# EAGLE design KickerBoard5 (EAGLE 6.5.0)
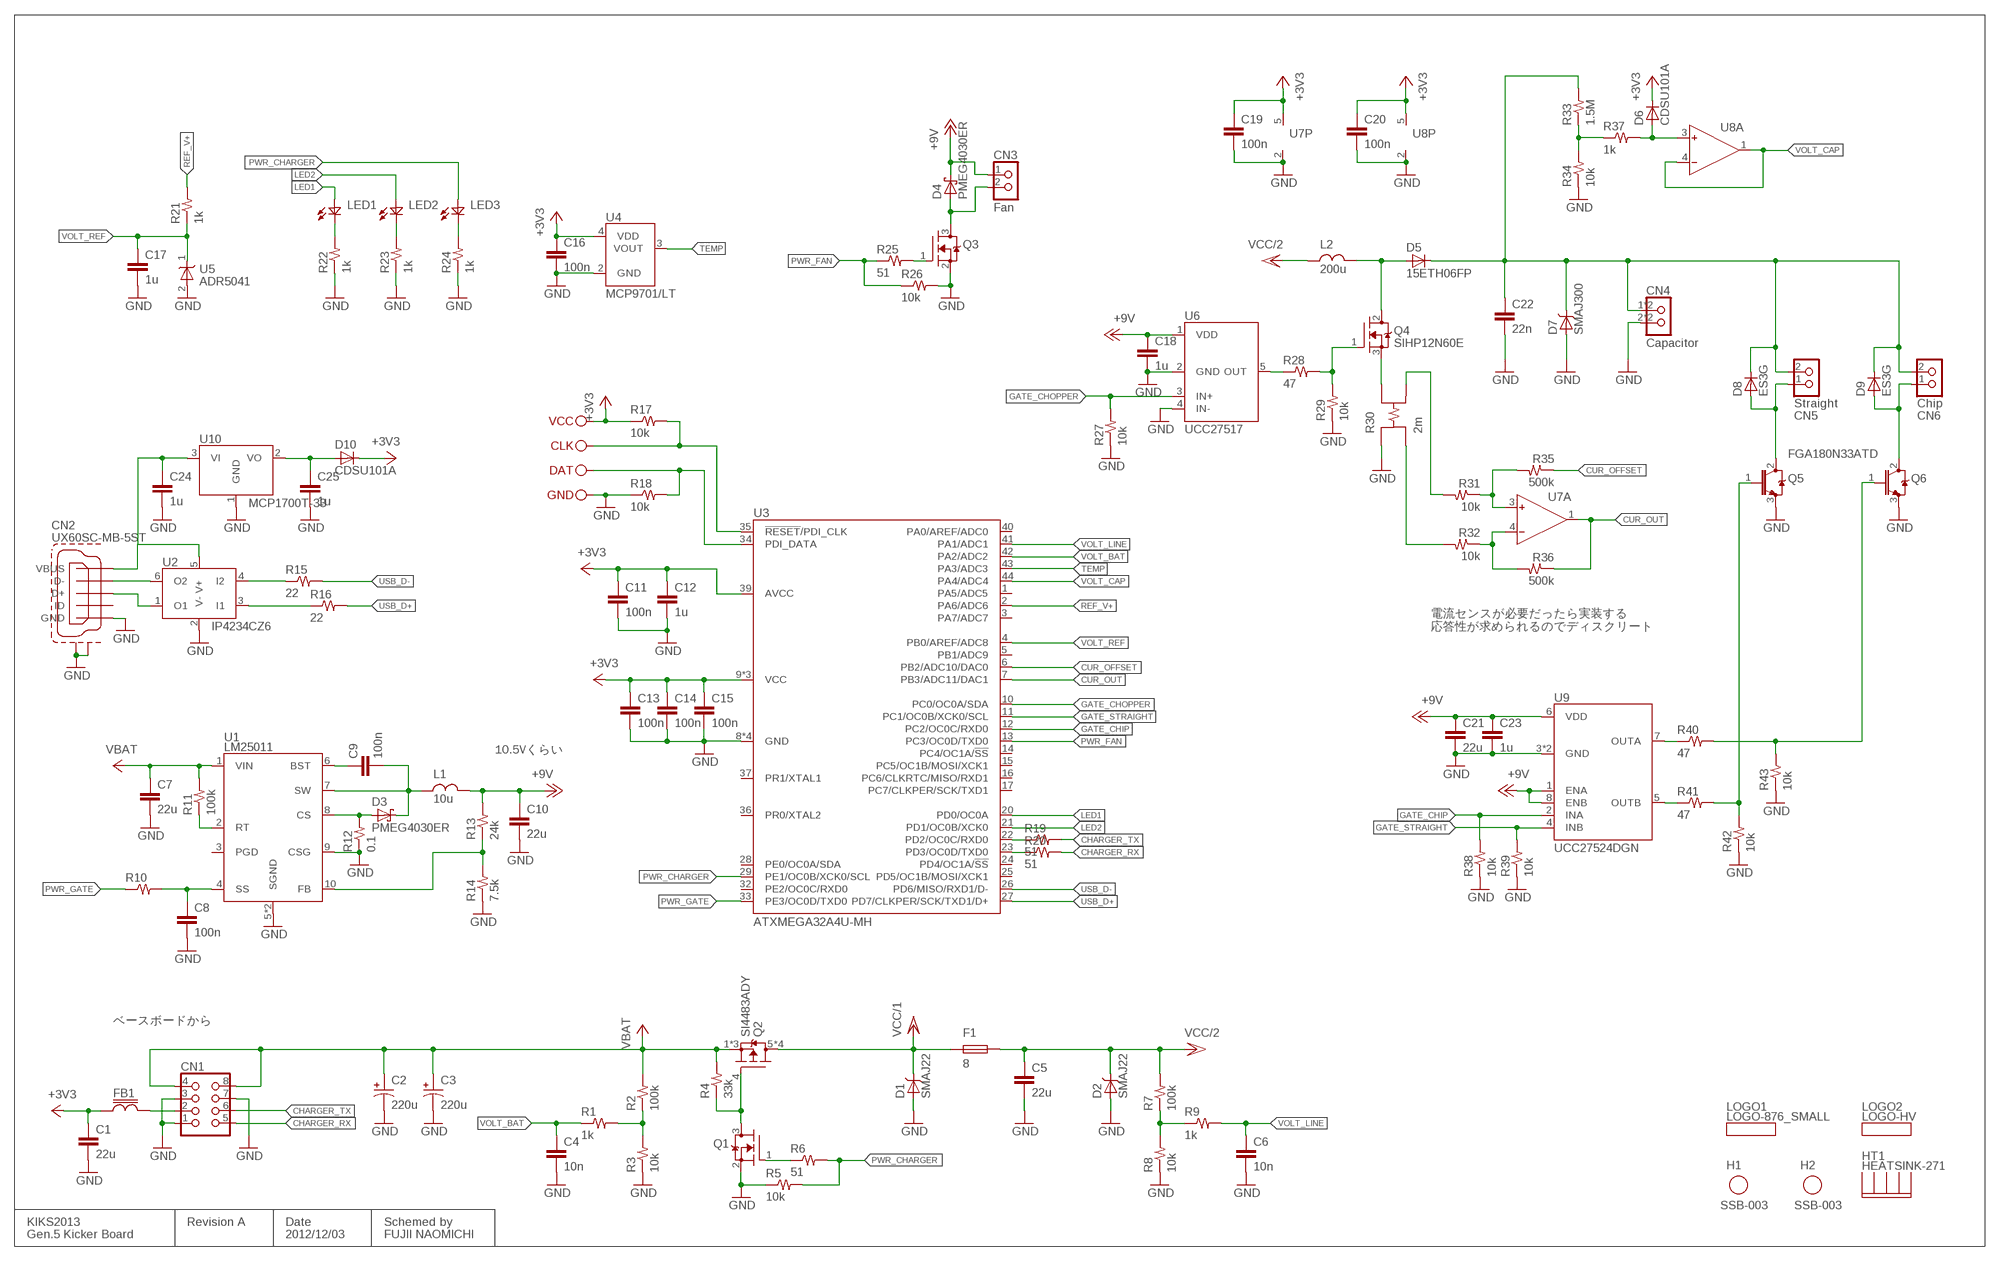
[diagram p0: schematic, sheet 1]

## Parts
C1  22u  C2012  [2012]
C2  220u  CPOL3.5-8  [E3.5-8]
C3  220u  CPOL3.5-8  [E3.5-8]
C4  10n  C1005  [1005]
C5  22u  C3225  [3225]
C6  10n  C1005  [1005]
C7  22u  C3216  [3216]
C8  100n  C1005  [1005]
C9  100n  C1608  [1608]
C10  22u  C3216  [3216]
C11  100n  C1005  [1005]
C12  1u  C1608  [1608]
C13  100n  C1005  [1005]
C14  100n  C1005  [1005]
C15  100n  C1005  [1005]
C16  100n  C1005  [1005]
C17  1u  C1005  [1005]
C18  1u  C1608  [1608]
C19  100n  C1005  [1005]
C20  100n  C1005  [1005]
C21  22u  C3216  [3216]
C22  22n  C3216  [3216]
C23  1u  C1608  [1608]
C24  1u  C1005  [1005]
C25  1u  C1005  [1005]
CN1  43045-0800  [43045-0800]
CN2  UX60SC-MB-5ST  [UX60SC-MB-5ST]
CN3  Fan  PIN1X2  [PIN1X2]
CN4  Capacitor  TERMINAL2P-V-SL  [TERMINAL2P-V-SCLEWLESS]
CN5  Straight  5569-02A2  [5569-02A2]
CN6  Chip  5569-02A2  [5569-02A2]
D1  SMAJ22  ZENER-DO-214AC  [DO-214AC]
D2  SMAJ22  ZENER-DO-214AC  [DO-214AC]
D3  PMEG4030ER  SBD-SDO123W  [SOD123W]
D4  PMEG4030ER  SBD-SDO123W  [SOD123W]
D5  15ETH06FP  DIODE-TO-220F  [TO-220F-2]
D6  CDSU101A  DIODE-1608  [1608]
D7  SMAJ300  ZENER-DO-214AC  [DO-214AC]
D8  ES3G  DIODE-DO-214AB  [DO-214AB]
D9  ES3G  DIODE-DO-214AB  [DO-214AB]
D10  CDSU101A  DIODE-1608  [1608]
F1  8  F3216  [3216]
FB1  FB1608  [1608]
H1  SSB-003  [SBB-003]
H2  SSB-003  [SBB-003]
HT1  HEATSINK-271  [271-AB]
L1  10u  L40  [L4040]
L2  200u  COIL-V  [COIL-V]
LED1  LED1608  [1608]
LED2  LED1608  [1608]
LED3  LED1608  [1608]
LOGO1  LOGO-876_SMALL  [LOGO-876_SMALL]
LOGO2  LOGO-HV  [LOGO-HIGHVOLTAGE]
P1  VCC  PAD  [PAD]
P2  CLK  PAD  [PAD]
P3  DAT  PAD  [PAD]
P4  GND  PAD  [PAD]
Q1  MOS-N-SOT23  [SOT23-3]
Q2  SI4483ADY  MOS-P-SOP8  [SOP8]
Q3  MOS-N-SOT23  [SOT23-3]
Q4  SIHP12N60E  MOS-N-TO-220F  [TO-220F]
Q5  FGA180N33ATD  IGBT-NTO-3P  [TO-3P]
Q6  FGA180N33ATD  IGBT-NTO-3P  [TO-3P]
R1  1k  R1005  [1005]
R2  100k  R1608  [1608]
R3  10k  R1608  [1608]
R4  33k  R1005  [1005]
R5  10k  R1005  [1005]
R6  51  R1005  [1005]
R7  100k  R1608  [1608]
R8  10k  R1608  [1608]
R9  1k  R1005  [1005]
R10  R1005  [1005]
R11  100k  R1005  [1005]
R12  0.1  R2012  [2012]
R13  24k  R1608  [1608]
R14  7.5k  R1608  [1608]
R15  22  R1005  [1005]
R16  22  R1005  [1005]
R17  10k  R1005  [1005]
R18  10k  R1005  [1005]
R19  51  R1005  [1005]
R20  51  R1005  [1005]
R21  1k  R1005  [1005]
R22  1k  R1005  [1005]
R23  1k  R1005  [1005]
R24  1k  R1005  [1005]
R25  51  R1005  [1005]
R26  10k  R1005  [1005]
R27  10k  R1005  [1005]
R28  47  R3216  [3216]
R29  10k  R1005  [1005]
R30  2m  FC4L  [FC4L]
R31  10k  R1608  [1608]
R32  10k  R1608  [1608]
R33  1.5M  R1608  [1608]
R34  10k  R1608  [1608]
R35  500k  R1608  [1608]
R36  500k  R1608  [1608]
R37  1k  R1005  [1005]
R38  10k  R1005  [1005]
R39  10k  R1005  [1005]
R40  47  R3216  [3216]
R41  47  R3216  [3216]
R42  10k  R1005  [1005]
R43  10k  R1005  [1005]
U1  LM25011  [MSOP10-PAD]
U2  IP4234CZ6  TPD2S017  [SOT23-6]
U3  ATXMEGA32A4U-MH  [QFN44-0.5]
U4  MCP9701/LT  [SC70-6]
U5  ADR5041  [SC70-3]
U6  UCC27517  [SOT23-5]
U7  SINGLE-OPAMP-ISO-SOT23  [SOT23-5]
U8  SINGLE-OPAMP-ISO-SOT23  [SOT23-5]
U9  UCC27524DGN  [MSOP8-PAD]
U10  MCP1700T-33  [SOT23-3]

## Nets
+3V3: C1.1 C11.1 C12.1 C13.1 C14.1 C15.1 C16.1 C19.1 C20.1 D6.K D10.K FB1.1 P1.1 R17.1 U3.9(VCC) U3.19(VCC) U3.31(VCC) U3.39(AVCC) U4.4(VDD) U7.5(P:V+) U8.5(P:V+)
+9V: C10.1 C18.1 C21.1 C23.1 CN3.1 D4.K L1.2 R13.2 U6.1(VDD) U9.1(ENA) U9.6(VDD) U9.8(ENB)
CHARGER_RX: CN1.5 R20.2
CHARGER_TX: CN1.6 R19.2
CUR_OFFSET: R35.1 U3.6(PB2/ADC10/DAC0)
CUR_OUT: R36.1 U3.7(PB3/ADC11/DAC1) U7.1(A:OUT)
GATE_CHIP: R38.2 U3.12(PC2/OC0C/RXD0) U9.2(INA)
GATE_CHOPPER: R27.2 U3.10(PC0/OC0A/SDA) U6.3(IN+)
GATE_STRAIGHT: R39.2 U3.11(PC1/OC0B/XCK0/SCL) U9.4(INB)
GND: C1.2 C2.N C3.N C4.2 C5.2 C6.2 C7.2 C8.2 C10.2 C11.2 C12.2 C13.2 C14.2 C15.2 C16.2 C17.2 C18.2 C19.2 C20.2 C21.2 C22.2 C23.2 C24.2 C25.2 CN1.1 CN1.3 CN1.7 CN2.5(GND) CN2.S1 CN2.S2 CN4.2 CN4.2B D1.A D2.A D7.A P4.1 Q1.2(S) Q3.2(S) Q5.3(E) Q6.3(E) R3.1 R5.1 R8.1 R12.1 R14.1 R18.1 R22.1 R23.1 R24.1 R26.2 R27.1 R29.1 R30.V1 R34.1 R38.1 R39.1 R42.1 R43.1 U1.5(SGND) U1.9(CSG) U1.PAD(SGND) U2.2(V-) U3.8(GND) U3.18(GND) U3.30(GND) U3.38(GND) U4.2(GND) U5.2(A) U6.2(GND) U6.4(IN-) U7.2(P:V-) U8.2(P:V-) U9.3(GND) U9.PAD(GND) U10.1(GND)
LED1: LED1.A U3.20(PD0/OC0A)
LED2: LED2.A U3.21(PD1/OC0B/XCK0)
N$1: R11.1 U1.2(RT)
N$2: R1.2 R2.1 R3.2
N$3: R7.1 R8.2 R9.1
N$4: R40.1 U9.7(OUTA)
N$5: P2.1 R17.2 U3.35(!RESET!/PDI_CLK)
N$6: Q4.3(S) R30.V2
N$7: C24.1 CN2.1(VBUS) U2.5(V+) U10.3(VI)
N$8: P3.1 R18.2 U3.34(PDI_DATA)
N$9: D5.3(A) L2.2 Q4.2(D)
N$10: D6.A R37.2 U8.3(A:IN+)
N$11: CN2.2(D-) U2.6(O2)
N$12: C8.1 R10.2 U1.4(SS)
N$13: C9.1 U1.6(BST)
N$14: R30.I2 R31.2
N$15: R31.1 R35.2 U7.3(A:IN+)
N$16: R32.1 R36.2 U7.4(A:IN-)
N$17: R13.1 R14.2 U1.10(FB)
N$18: Q6.1(G) R40.2 R43.2
N$19: C9.2 D3.K L1.1 U1.7(SW)
N$20: CN2.3(D+) U2.1(O1)
N$21: CN5.1 D8.A Q5.2(C)
N$22: Q1.3(D) Q2.4(G) R4.1
N$23: R28.1 U6.5(OUT)
N$24: CN6.1 D9.A Q6.2(C)
N$25: Q4.1(G) R28.2 R29.2
N$26: LED2.K R23.2
N$27: R41.1 U9.5(OUTB)
N$28: Q5.1(G) R41.2 R42.2
N$29: R30.I1 R32.2
N$30: R19.1 U3.22(PD2/OC0C/RXD0)
N$31: D3.A R12.2 U1.8(CS)
N$32: R20.1 U3.23(PD3/OC0D/TXD0)
N$33: CN1.2 FB1.2
N$34: LED1.K R22.2
N$35: LED3.K R24.2
N$36: C25.1 D10.A U10.2(VO)
N$37: CN3.2 D4.A Q3.3(D)
N$38: R16.1 U2.3(I1)
N$39: Q3.1(G) R25.2
N$40: R15.1 U2.4(I2)
N$43: Q1.1(G) R6.1
PWR_CHARGER: LED3.A R5.2 R6.2 U3.29(PE1/OC0B/XCK0/SCL)
PWR_FAN: R25.1 R26.1 U3.13(PC3/OC0D/TXD0)
PWR_GATE: R10.1 U3.33(PE3/OC0D/TXD0)
REF_V+: R21.2 U3.2(PA6/ADC6)
TEMP: U3.43(PA3/ADC3) U4.3(VOUT)
USB_D+: R16.2 U3.27(PD7/CLKPER/SCK/TXD1/D+)
USB_D-: R15.2 U3.26(PD6/MISO/RXD1/D-)
VBAT: C2.P C3.P C7.1 CN1.4 CN1.8 Q2.1(S) Q2.2(S) Q2.3(S) R2.2 R4.2 R11.2 U1.1(VIN)
VCAP: C22.1 CN4.1 CN4.1B CN5.2 CN6.2 D5.1(K) D7.K D8.K D9.K R33.2
VCC/1: D1.K F1.1 Q2.5(D) Q2.6(D) Q2.7(D) Q2.8(D)
VCC/2: C5.1 D2.K F1.2 L2.1 R7.2
VOLT_BAT: C4.1 R1.1 U3.42(PA2/ADC2)
VOLT_CAP: U3.44(PA4/ADC4) U8.1(A:OUT) U8.4(A:IN-)
VOLT_LINE: C6.1 R9.2 U3.41(PA1/ADC1)
VOLT_LINE1: R33.1 R34.2 R37.1
VOLT_REF: C17.1 R21.1 U3.4(PB0/AREF/ADC8) U5.1(K)
Unconnected: CN2.4(ID) U1.3(PGD) U3.1(PA5/ADC5) U3.3(PA7/ADC7) U3.5(PB1/ADC9) U3.14(PC4/OC1A/!SS) U3.15(PC5/OC1B/MOSI/XCK1) U3.16(PC6/CLKRTC/MISO/RXD1) U3.17(PC7/CLKPER/SCK/TXD1) U3.24(PD4/OC1A/!SS) U3.25(PD5/OC1B/MOSI/XCK1) U3.28(PE0/OC0A/SDA) U3.32(PE2/OC0C/RXD0) U3.36(PR0/XTAL2) U3.37(PR1/XTAL1) U3.40(PA0/AREF/ADC0)

## Notes on the sheet
- 電流センスが必要だったら実装する
  応答性が求められるのでディスクリート
- 10.5Vくらい
- ベースボードから
- KIKS2013 | Revision A | Date | Schemed by
- Gen.5 Kicker Board | 2012/12/03 | FUJII NAOMICHI

## Library data of the parts
C1 C4-C25 = Passive:C
C2 C3 = Passive:CPOL
CN1 = con-Molex:43045-0800
CN2 = con-Hirose:UX60S
CN3 = Connector:PIN1X2
CN4 = ProjectOnly:TERMINAL2P
CN5 CN6 = con-Molex:5569-02A2
D1 D2 D7 = Diode:ZENER-*
D3 D4 = Diode:SBD-*
D5 D6 D8-D10 = Diode:DIODE-*
F1 = Passive:F
FB1 = Passive:FB
H1 H2 = ProjectOnly:SSB-00*
HT1 = ProjectOnly:HEATSINK
L1 = Passive:L
L2 = ProjectOnly:COIL
LED1-LED3 = Opto:LED
LOGO1 = ProjectOnly:LOGO-876_SMALL
LOGO2 = ProjectOnly:LOGO-HV
P1-P4 = ic-package:PAD
Q1 Q3 Q4 = Transistor:MOS-N-*
Q2 = Transistor:MOS-P-*
Q5 Q6 = Transistor:IGBT-N
R1-R29 R31-R43 = Passive:R
R30 = ProjectOnly:FC4L
U1 = ic-National:LM25011
U2 = ic-TI:TPD2S017
U3 = ic-ATMEL:ATXMEGA*A4U
U4 = ic-Microchip:MCP970*
U5 = ic-AD:ADR504*
U6 = ic-TI:UCC27517
U7 U8 = Opamp:SINGLE-OPAMP-ISO
U9 = ic-TI:UCC27524
U10 = ic-Microchip:MCP1700T-*

## Board
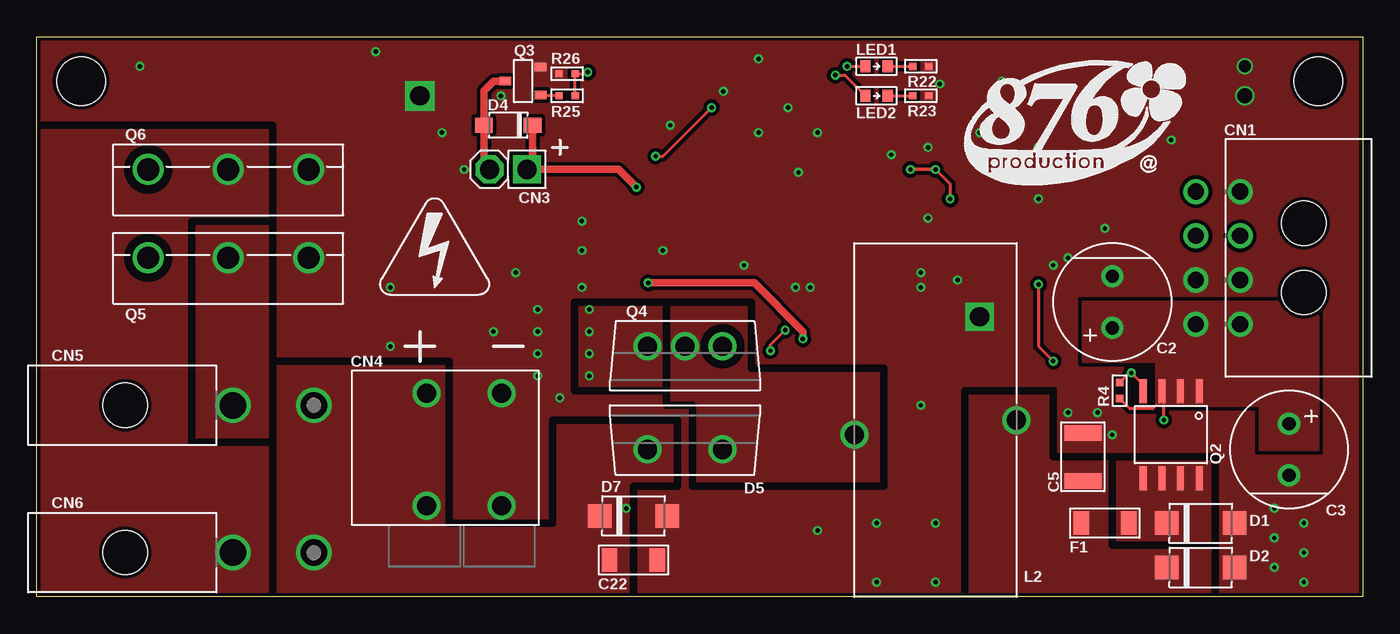
[diagram p1: board, top side]
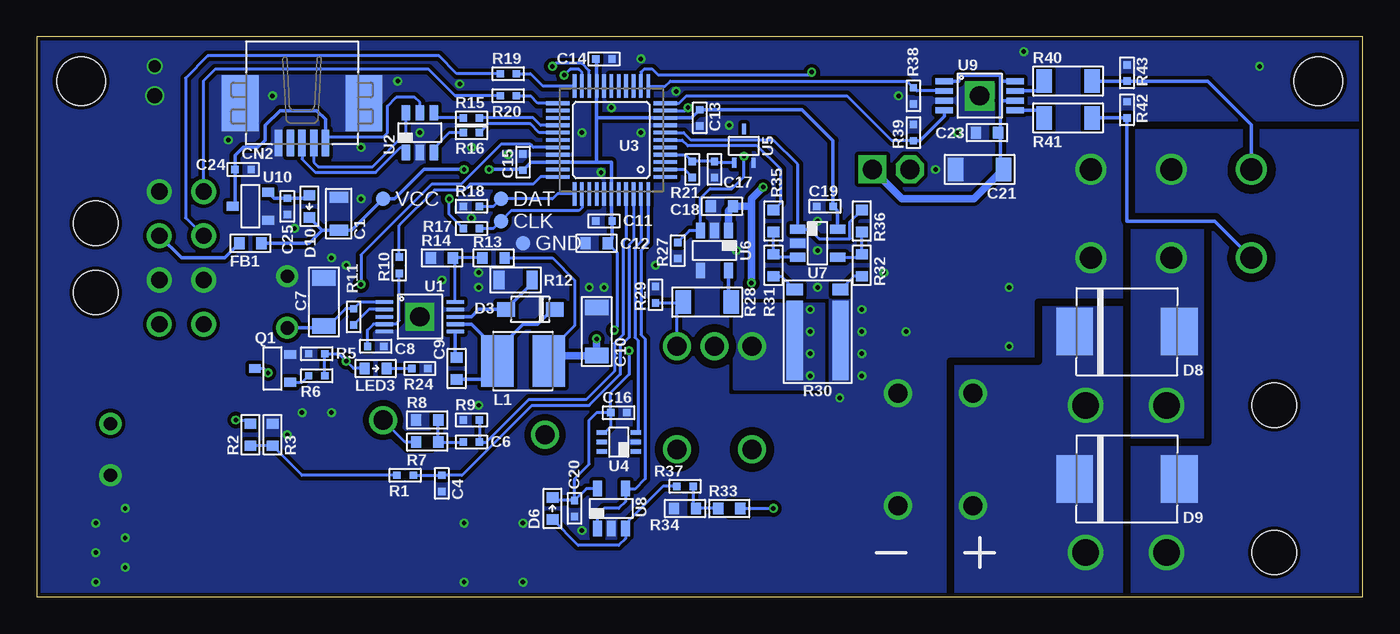
[diagram p2: board, bottom side, seen from below]

Size 90 x 38 mm. Coordinates in mm from the lower left corner, seen from the top.
Outline: 90,0 0,0 0,38 90,38 90,0
Copper layers (1*16): Top 0.035mm / dielectric 1.6mm / Bottom 0.035mm
Design rules "seeedstudio": minimum track width 6mil, minimum drill 0.3mm, track to track 6mil, track to pad 6mil, pad to pad 6mil, via to via 6mil, smd to smd 6mil, copper to edge 10mil, drill to drill 10mil, minimum pad ring 0.2mm, minimum via ring 6mil, stop-mask expansion 4mil, vias tented up to drill 3mm, thermal gap 10mil
tRestrict: area 6.2,21.7 to 8.9,24.3; area 6.2,27.7 to 8.9,30.3; area 45.3,15.8 to 47.8,18.2; 37 lines
bRestrict: area 40.2,8.8 to 42.7,11.2; area 45.3,8.8 to 47.8,11.2; area 54.4,9.9 to 56.6,12.1; area 42.8,15.8 to 45.2,18.2; 37 lines

### Footprints (pad centres in the part's own frame; a part is rotated, then mirrored left to right if it is on the bottom)
2012 = smd 0.75 x 1.25: 1 -1.125,0; 2 1.125,0
E3.5-8 = drill 0.9 pad 1.5: N 1.75,0; P -1.75,0
1005 = smd 0.5 x 0.5: 1 -0.55,0; 2 0.55,0
3225 = smd 1.05 x 2.5: 1 -1.625,0; 2 1.625,0
3216 = smd 1.05 x 1.6: 1 -1.625,0; 2 1.625,0
1608 = smd 0.7 x 0.8: 1 -0.75,0; 2 0.75,0
43045-0800 = drill 1.1 pad 1.7: 1 -4.5,-4.32; 2 -1.5,-4.32; 3 1.5,-4.32; 4 4.5,-4.32; 5 -4.5,-7.32; 6 -1.5,-7.32; 7 1.5,-7.32; 8 4.5,-7.32 | hole 3: 2.35,0; -2.35,0
UX60SC-MB-5ST = smd 1.8 x 0.5: 1 2.7,1.6; 2 2.7,0.8; 3 2.7,0; 4 2.7,-0.8; 5 2.7,-1.6 | smd 3.8 x 2.5: S1 0,-4.2; S2 0,4.2
PIN1X2 = drill 1.3 square: 1 -1.27,0 | drill 1.3 octagon: 2 1.27,0
TERMINAL2P-V-SCLEWLESS = drill 1.3 pad 1.9: 1 -2.54,-3.81; 1B -2.54,3.81; 2 2.54,-3.81; 2B 2.54,3.81
5569-02A2 = drill 1.8 pad 2.4: 1 0,-7.3; 2 0,-12.8 | hole 3: 0,0
DO-214AC = smd 1.6 x 1.6: A 2.3,0; K -2.3,0
SOD123W = smd 1.2 x 1: A 1.65,0; K -1.65,0
TO-220F-2 = drill 1.3 pad 1.9: 1 -2.54,0; 3 2.54,0
1608' = smd 0.7 x 0.8: A 0.75,0; K -0.75,0
DO-214AB = smd 2.5 x 3.2: A 3.55,0; K -3.55,0
SBB-003 = hole 3.3: 0,0
L4040 = smd 2.2 x 3.5: 1 -1.75,0; 2 1.75,0
COIL-V = drill 1.3 pad 1.9: 1 -5.5,0; 2 5.5,1
PAD = smd 1 x 1: 1 0,0
SOT23-3 = smd 0.6 x 0.8: 1 -0.95,-1.2; 2 0.95,-1.2; 3 0,1.2
SOP8 = smd 0.48 x 1.6: 1 -1.905,-2.95; 2 -0.635,-2.95; 3 0.635,-2.95; 4 1.905,-2.95; 5 1.905,2.95; 6 0.635,2.95; 7 -0.635,2.95; 8 -1.905,2.95
TO-220F = drill 1.3 pad 1.9: 1 -2.54,0; 2 0,0; 3 2.54,0
TO-3P = drill 1.5 pad 2.1: 1 -5.45,0; 2 0,0; 3 5.45,0
FC4L = smd 1.1 x 0.8: I1 -1.55,-2.85; I2 1.55,-2.85 | smd 1.1 x 5.4: V1 -1.55,0.6; V2 1.55,0.6
MSOP10-PAD = smd 0.25 x 1.2: 1 -1,-2.4; 2 -0.5,-2.4; 3 0,-2.4; 4 0.5,-2.4; 5 1,-2.4; 6 1,2.4; 7 0.5,2.4; 8 0,2.4; 9 -0.5,2.4; 10 -1,2.4 | drill 1.3 pad 1.9 square: PAD 0,0
SOT23-6 = smd 0.6 x 1.05: 1 -0.95,-1.35; 2 0,-1.35; 3 0.95,-1.35; 4 0.95,1.35; 5 0,1.35; 6 -0.95,1.35
QFN44-0.5 = smd 1.6 x 0.25: 1 -3.65,2.5; 2 -3.65,2; 3 -3.65,1.5; 4 -3.65,1; 5 -3.65,0.5; 6 -3.65,0; 7 -3.65,-0.5; 8 -3.65,-1; 9 -3.65,-1.5; 10 -3.65,-2; 11 -3.65,-2.5; 23 3.65,-2.5; 24 3.65,-2; 25 3.65,-1.5; 26 3.65,-1; 27 3.65,-0.5; 28 3.65,0; 29 3.65,0.5; 30 3.65,1; 31 3.65,1.5; 32 3.65,2; 33 3.65,2.5 | smd 0.25 x 1.6: 12 -2.5,-3.65; 13 -2,-3.65; 14 -1.5,-3.65; 15 -1,-3.65; 16 -0.5,-3.65; 17 0,-3.65; 18 0.5,-3.65; 19 1,-3.65; 20 1.5,-3.65; 21 2,-3.65; 22 2.5,-3.65; 34 2.5,3.65; 35 2,3.65; 36 1.5,3.65; 37 1,3.65; 38 0.5,3.65; 39 0,3.65; 40 -0.5,3.65; 41 -1,3.65; 42 -1.5,3.65; 43 -2,3.65; 44 -2.5,3.65
SC70-6 = smd 0.3 x 0.7: 1 -0.65,-1.15; 2 0,-1.15; 3 0.65,-1.15; 4 0.65,1.15; 5 0,1.15; 6 -0.65,1.15
SC70-3 = smd 0.3 x 0.7: 1 -0.65,-1.15; 2 0.65,-1.15; 3 0,1.15
SOT23-5 = smd 0.6 x 1.05: 1 -0.95,-1.35; 2 0,-1.35; 3 0.95,-1.35; 4 0.95,1.35; 5 -0.95,1.35
MSOP8-PAD = smd 0.4 x 1.2: 1 -0.975,-2.4; 2 -0.325,-2.4; 3 0.325,-2.4; 4 0.975,-2.4; 5 0.975,2.4; 6 0.325,2.4; 7 -0.325,2.4; 8 -0.975,2.4 | drill 1.3 pad 2 square: PAD 0,0

### Placement (x,y rotation side)
C1  69.5,26 90 bottom
C2  73,20 90 top
C3  85,10 270 top
C4  62.5,7.7 270 bottom
C5  71,9.5 90 top
C6  60.5,12 180 bottom
C7  70.5,20 90 bottom
C8  67,17 0 bottom
C9  61.5,15.5 270 bottom
C10  52,18 90 bottom
C11  51.5,25.5 180 bottom
C12  52,24 180 bottom
C13  45,32.5 270 bottom
C14  51.5,36.5 0 bottom
C15  57,29.5 90 bottom
C16  50.5,12.5 0 bottom
C17  44,29 270 bottom
C18  43.5,26.5 180 bottom
C19  36.5,26.5 180 bottom
C20  53.5,6 270 bottom
C21  26,29 180 bottom
C22  40.5,2.5 0 top
C23  25.5,31.5 180 bottom
C24  76,29 0 bottom
C25  73,26.5 270 bottom
CN1  86,23 270 top
CN2  72,33.5 270 bottom
CN3  32,29 180 top
CN4  29,10 0 top
CN5  6,13 90 top
CN6  6,3 90 top
D1  79,5 0 top
D2  79,2 0 top
D3  56.5,19.5 180 bottom
D4  32,32 180 top
D5  44,10 0 top
D6  CDSU101A  [1608']  55,6 270 bottom
D7  40.5,5.5 0 top
D8  16,18 0 bottom
D9  16,8 0 bottom
D10  CDSU101A  [1608']  71.5,26.5 90 bottom
F1  72.5,5 180 top
FB1  75.5,24 180 bottom
H1  3,35 0 top
H2  87,35 0 top
HT1  44,13 0 top
L1  57,16 0 bottom
L2  61,12 180 top
LED1  [1608']  57,36 180 top
LED2  [1608']  57,34 180 top
LED3  [1608']  67,15.5 180 bottom
LOGO1  63,28 0 top
LOGO2  27,23.5 0 top
P1  66.5,27 0 bottom
P2  58.5,25.5 0 bottom
P3  58.5,27 0 bottom
P4  57,24 0 bottom
Q1  74,15.5 90 bottom
Q2  77,11 180 top
Q3  33,35 90 top
Q4  44,17 180 top
Q5  13,23 0 top
Q6  13,29 0 top
R1  65,8.25 180 bottom
R2  75.5,11 90 bottom
R3  74,11 270 bottom
R4  73.5,14 270 top
R5  71,16.5 0 bottom
R6  71,15 0 bottom
R7  63.5,10.5 180 bottom
R8  63.5,12 0 bottom
R9  60.5,10.5 0 bottom
R10  65.4,22.5 270 bottom
R11  68.5,19 90 bottom
R12  57.5,21.5 0 bottom
R13  59,23 0 bottom
R14  62.5,23 0 bottom
R15  60.5,32.5 0 bottom
R16  60.5,31.5 0 bottom
R17  60.5,25 0 bottom
R18  60.5,26.5 0 bottom
R19  58,35.5 180 bottom
R20  58,34 180 bottom
R21  45.5,29 270 bottom
R22  60,36 180 top
R23  60,34 180 top
R24  64,15.5 180 bottom
R25  36,34 180 top
R26  36,35.5 180 top
R27  46.5,23.5 90 bottom
R28  44.5,20 180 bottom
R29  48,20.5 270 bottom
R30  37,18 180 bottom
R31  40,22.5 270 bottom
R32  34,22.5 270 bottom
R33  43,6 0 bottom
R34  46,6 0 bottom
R35  40,25.5 270 bottom
R36  34,25.5 270 bottom
R37  46,7.5 180 bottom
R38  30.5,34 90 bottom
R39  30.5,31.5 270 bottom
R40  20,35 0 bottom
R41  20,32.5 0 bottom
R42  16,33.05 270 bottom
R43  16,35.55 270 bottom
U1  64,19 270 bottom
U2  64,31.5 0 bottom
U3  51,31 180 bottom
U4  50.5,10.5 90 bottom
U5  42,30.6 0 bottom
U6  44,23.5 180 bottom
U7  37,24 270 bottom
U8  51,6 0 bottom
U9  26,34 270 bottom
U10  75.5,26.5 90 bottom

### Tracks (layer width: path | path; a pad name or v marks a point on that pad's centre or on a via)
+3V3  (via drill 0.3)
  Top 0.2: v62,27 62,28 v61,29 | v49.8,16.7 49.8,17.1 v50.8,18.1
  Top 0.25: v59.3,29 v61,29
  Bottom 0.2: 57.05,29 C15.1 | R17.1 62,25.95 v62,27 | C12.1 50.6,23.35 50.6,18.3 v50.8,18.1 | v49.8,16.7 49.8,15.1 51.05,13.85 C16.1 | C20.1 53.5,8 52.5,9 52.5,12 52,12.5 C16.1 | C16.1 51.05,11.55 51.45,11.15 U4.4 | U8.5 52.7,7.35 C20.1 | C20.1 54.8,6.55 D6.K
  Bottom 0.25: C14.1 52,36.45 U3.19 52,32.5 | C15.1 56.45,29.5 U3.31 52,29.5 | 52,32.5 U3.9 45.55,32.5 C13.1 38.05,33.05 35.95,30.95 C19.1 35.65,26.2 U7.5 | 52,32.5 52,29.5 | v59.3,29 57.05,29 | 52,29.5 51,29.5 U3.39 51,25.55 C11.1 50.95,24.3 C12.1 | v61,29 63.7,29 65.7,27 P1.1 68.62,24.88 C1.1 70.62,24.88 | FB1.1 71.5,24 70.62,24.88 | 70.62,24.88 D10.K
+9V  (via drill 0.3)
  Top 0.5: v41.5,21.3 48.7,21.3 52,18 v52,17.5 | v40.7,27.8 39.5,29 CN3.1 33.65,29.38 D4.K
  Bottom 0.2: R13.2 55,23 53.5,21.5 53.5,18.4 55.25,16.65 L1.2
  Bottom 0.25: U9.6 24.6,33.67 | U9.8 24.6,34.98 | 24.6,34.98 24.6,33.67 | U9.1 27.4,34.98 27.4,35.4 24.6,35.4 24.6,34.98 | 24.6,33.67 24.6,31.5 | 24.6,31.5 24.6,29.23 C21.1 | C23.1 24.6,31.5
  Bottom 0.5: L1.2 54.88,16.38 C10.1 v52,17.5 | v41.5,21.3 41.5,26.5 | 41.5,26.5 41.5,27 v40.7,27.8 | C21.1 26.38,27 31.27,27 CN3.1 | 41.5,26.5 C18.1 43.05,26.2 U6.1
CHARGER_RX
  Bottom 0.2: R20.2 61.6,34 63.4,35.8 77.9,35.8 78.68,35.02 CN1.5
CHARGER_TX
  Bottom 0.2: R19.2 61.5,35.5 62.7,36.7 78.4,36.7 79.9,35.2 79.9,25.72 CN1.6
CUR_OFFSET
  Bottom 0.2: U3.6 46.2,31 45.8,30.6 41.1,30.6 39.5,29 39.5,26.75 R35.1
CUR_OUT
  Bottom 0.2: U3.7 46.1,31.5 45.6,31 40,31 38.35,29.35 U7.1 37.55,24.95 36.9,24.3 34.8,24.3 34.8,25.45 R36.1
GATE_CHIP
  Bottom 0.2: U3.12 47.35,34.65 47,35 30.95,35 R38.2 30.27,34.33 U9.2
GATE_CHOPPER  (via drill 0.3)
  Top 0.2: v42,29.9 42.5,29.9 v45.8,33.2
  Bottom 0.2: R27.2 45.7,24.85 U6.3 44.95,27.05 44.3,27.7 42.8,27.7 42,28.5 v42,29.9 | U3.10 46,33 v45.8,33.2
GATE_STRAIGHT
  Bottom 0.2: U3.11 46.4,33.5 45.9,34 35,34 31.95,30.95 R39.2
  Bottom 0.25: R39.2 30.05,30.95 28.4,32.6 U9.4
GND  (via drill 0.3, 0.8, 1)
  other vias: 64,31.5 37,25.5 37,23.5 68,30.5 77,31 65.5,35 74,34 51.7,28.8 49,31.5 51,33.2 53,31.5 68,27 58,30 84,6 84,4 86,5 86,1 86,3 84,2 70,12.5 72,12.5 73,11 7,36 23,37 31.5,34 27.5,31.5 29,29 32.5,22 62.5,21.5 51.5,21 52.5,21 60,22 60,21 69,22.5 70,23 57,5 61,5 61,1 57,1 46.6,34.3 43,32 49,36.5 24,17 24,21 31,18 34,19.5 34,18 34,16.5 34,15 35.5,13.5 37,21 60.5,25.7 48,22.5 61.3,34.8 53,4.5 42.5,23.5 60.5,30.5 60,13 82,36 82,34 72.5,25
  pour Top (isolate 0.25, rank 6, no thermals): -1,39 91,39 91,-1 -1,-1
  pour Bottom (isolate 0.25, rank 6, no thermals): -2,40 92,40 92,-2 -2,-2
LED1  (via drill 0.3)
  Top 0.2: v55,36 LED1.A
  Bottom 0.2: U3.20 52.5,35.7 53,36.2 54.8,36.2 v55,36
LED2  (via drill 0.3)
  Top 0.2: v54.2,35.4 54.85,35.4 LED2.A
  Bottom 0.2: U3.21 53,35.6 53.2,35.8 53.8,35.8 v54.2,35.4
N$1
  Bottom 0.2: U1.2 67.45,19.5 R11.1
N$2
  Bottom 0.2: R1.2 72,8.25 R3.2 R2.1
N$3
  Bottom 0.2: R8.2 R7.1 R9.1
N$4
  Bottom 0.25: U9.7 21.62,34.33 R40.1
N$5
  Bottom 0.2: U3.35 53,26.4 53.2,26.2 57.8,26.2 P2.1 59,25 R17.2
N$6  (via drill 0.3)
  other vias: 37.5,19.5 37.5,18 37.5,16.5 37.5,15
  pour Bottom (isolate 0.2, rank 4, no thermals): 36.6,19.9 36.6,14.1 42.65,14.1 42.65,19.9
  pour Top (isolate 0.25, rank 4, no thermals): 36.6,19.9 36.6,14.1 42.65,14.1 42.65,19.9
N$7
  Bottom 0.2: CN2.1 70.4,31.2 66.5,31.2 66.2,31.5 66.2,33.3 65.6,33.9 64.35,33.9 64,33.55 U2.5
  Bottom 0.25: U10.3 76.55,26.65 C24.1 76.55,29.95 76,30.5 75,30.5 74.5,31 74.5,32 73.5,33 71,33 70.4,32.4 CN2.1
N$8
  Bottom 0.2: U3.34 54.65,27.35 55,27 P3.1 59,26.5 R18.2
N$9
  pour Top (isolate 0.25, rank 2, no thermals): 42.85,19.9 42.85,13.1 44.6,13.1 44.6,7.6 57.4,7.6 57.4,15.4 48.4,15.4 48.4,19.9
N$10
  Bottom 0.2: R37.2 47.5,7.5 50.05,4.95 U8.3 50.05,3.95 50.5,3.5 53.25,3.5 D6.A
N$11
  Bottom 0.2: CN2.2 71.2,29.5 70.9,29.2 67.2,29.2 64.95,31.45 U2.6
N$12
  Bottom 0.2: C8.1 67.55,18.1 67.15,18.5 U1.4 65.65,18.5 65.4,18.75 R10.2
N$13
  Bottom 0.25: U1.6 61.6,16.35 C9.1
N$14
  Bottom 0.2: R31.2 39.45,21.75 R30.I2
N$15
  Bottom 0.2: U7.3 39.8,23.05 R31.1 R35.2
N$16
  Bottom 0.2: U7.4 34.2,23.05 R32.1 R36.2
N$17
  Bottom 0.2: U1.10 61.6,22.85 R14.2 R13.1
N$18
  Bottom 0.25: Q6.1 7.55,32.05 10.5,35 R43.2 R40.2
N$19
  Bottom 0.25: U1.7 60.5,18.5 58.75,16.75 | 58.75,16.75 58.67,16.68 58.75,16.6 L1.1 58.75,14.75 C9.2 | D3.K 55,19.5 56,18.5 57,18.5 58.75,16.75
N$20
  Bottom 0.2: CN2.3 72,29.7 71.1,28.8 67,28.8 65.3,30.5 64.95,30.5 U2.1
N$21
  pour Top (isolate 0.25, rank 2, no thermals): 10.6,25.4 10.6,10.6 15.9,10.6 15.9,25.4
  pour Bottom (isolate 0.25, rank 2, no thermals): 10.6,25.4 10.6,10.6 15.9,10.6 15.9,25.4
N$22  (via drill 0.3)
  Top 0.2: Q2.4 75.09,14.4 v74.3,15.2 74.15,15.2 R4.1
  Bottom 0.2: Q1.3 74.6,15.5 v74.3,15.2
N$23
  Bottom 0.25: U6.5 43.05,20.18 R28.1
N$24
  pour Top (isolate 0.25, rank 3, no thermals): 0.1,31.9 0.1,0.1 15.9,0.1 15.9,10.4 10.4,10.4 10.4,25.6 15.9,25.6 15.9,31.9
  pour Bottom (isolate 0.25, rank 3, no thermals): 15.9,31.9 15.9,25.6 10.4,25.6 10.4,10.4 15.9,10.4 15.9,0.1 0.1,0.1 0.1,31.9
N$25
  Bottom 0.2: Q4.1 46.54,19.59 R28.2 46.17,19.95 R29.2
N$26
  Top 0.2: LED2.K R23.2
N$27
  Bottom 0.25: U9.5 21.62,33.02 R41.1
N$28
  Bottom 0.25: Q5.1 10.05,25.5 16,25.5 R42.2 R41.2
N$29
  Bottom 0.2: R32.2 34.55,21.75 R30.I1
N$30
  Bottom 0.2: U3.22 55.65,34.65 56.5,35.5 R19.1
N$31
  Bottom 0.25: U1.8 60.5,19 60,19.5 D3.A 56.38,21.27 R12.2
N$32
  Bottom 0.2: U3.23 56,33.5 56.5,34 R20.1
N$33
  Bottom 0.25: CN1.2 80.18,23 77.25,23 FB1.2
N$34
  Top 0.2: LED1.K R22.2
N$35
  Bottom 0.2: LED3.K R24.2
N$36
  Bottom 0.25: U10.2 73.9,27.05 C25.1 71.7,27.05 D10.A
N$37
  Top 0.5: CN3.2 30.35,29.38 D4.A 30.35,34.35 31,35 Q3.3
N$38
  Bottom 0.2: R16.1 62,31.5 63.05,30.45 U2.3
N$39
  Top 0.2: R25.2 34.25,34 Q3.1
N$40
  Bottom 0.2: R15.1 63.05,32.5 U2.4
N$43
  Bottom 0.2: Q1.1 72,14.55 R6.1
PWR_CHARGER  (via drill 0.3)
  Top 0.2: v68,21.2 68,17 v69,16
  Bottom 0.2: R6.2 R5.2 69.5,16.5 v69,16 68.5,15.5 LED3.A | v68,21.2 68,23.2 63.2,28 61.2,28 58.5,30.7 56.5,30.7 56.3,30.5 U3.29
PWR_FAN  (via drill 0.3)
  Top 0.2: v37.4,35.6 37.3,35.5 R26.1 R25.1
  Bottom 0.2: v37.4,35.6 37.6,35.4 47.8,35.4 48.2,35.8 48.8,35.8 49,35.6 U3.13
PWR_GATE
  Bottom 0.2: R10.1 65.4,25.2 63,27.6 61,27.6 60.6,28 56.3,28 55.8,28.5 U3.33
REF_V+
  Bottom 0.2: U3.2 46.05,29 R21.2
TEMP
  Bottom 0.2: U3.43 49,24.1 49.4,23.7 49.4,17.6 49.2,17.4 49.2,11.15 U4.3
USB_D+
  Bottom 0.2: U3.27 55.9,31.5 56.5,32.1 59.35,32.1 R16.2
USB_D-
  Bottom 0.2: U3.26 55.8,32 56.3,32.5 R15.2
VBAT  (via drill 0.3)
  Top 0.2: v76.5,12 76.5,13 | 76,13 75.75,12.75 74.2,12.75 R4.2
  Bottom 0.2: v76.5,12 75.75,12 R2.2 | U1.1 68.05,20 R11.2 69.05,19.55 70.22,18.38 C7.1
  Bottom 0.25: C2.P 70.62,18.25 C7.1
  pour Top (isolate 0.25, no thermals): 71,20 71,16 76,16 76,13 83,13 83,10 87,10 87,20
VCAP  (via drill 0.3)
  Bottom 0.2: R33.2 v40,6
  pour Top (isolate 0.25, no thermals): 27.9,15.9 27.9,4.9 35.1,4.9 35.1,11.9 43.4,11.9 43.4,7.6 40.4,7.6 40.4,0.1 16.1,0.1 16.1,15.9
  pour Bottom (isolate 0.25, no thermals): 27.9,15.9 27.9,0.1 16.1,0.1 16.1,19.9 21.9,19.9 21.9,15.9
VCC/1
  pour Top (isolate 0.25, no thermals): 73.1,9.4 73.1,3.6 79.9,3.6 79.9,9.4
VCC/2
  Bottom 0.2: R7.2 65,10.5 L2.1
  pour Top (isolate 0.25, rank 2, no thermals): 63.1,13.9 63.1,0.1 79.9,0.1 79.9,3.4 72.9,3.4 72.9,9.4 68.9,9.4 68.9,13.9
VOLT_BAT
  Bottom 0.2: U3.42 49.5,24.2 49.8,23.9 49.8,17.6 50.4,17 50.4,15.1 52.5,13 56.4,13 61.15,8.25 C4.1 R1.1
VOLT_CAP
  Bottom 0.2: U8.4 50.05,6.45 50.5,6 51.5,6 51.95,5.55 U8.1 | U3.44 48.5,24 49,23.5 49,17.8 48.7,17.5 48.7,8 49.35,7.35 U8.4 | 50,7.4 U8.4
VOLT_LINE
  Bottom 0.2: U3.41 50,24.3 50.2,24.1 50.2,17.8 50.8,17.2 50.8,15.3 52.7,13.4 56.6,13.4 59.5,10.5 R9.2 C6.1
VOLT_LINE1
  Bottom 0.2: R33.1 R34.2 45.45,6.2 R37.1
VOLT_REF
  Bottom 0.2: U3.4 45.95,30 R21.1 C17.1 43.9,29.45 U5.1